# Altium project Sonar_Digital_Shield.PrjPcb
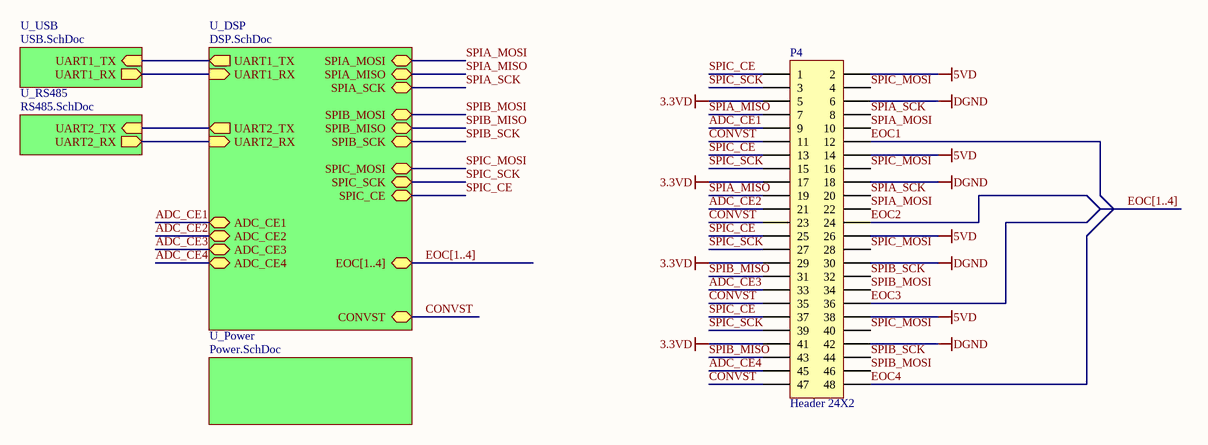
[diagram p0: Top_Level.SchDoc]
4 sheets, 71 parts. Net scope: hierarchical (ports join the sheet entries above them; power ports are global).
Board file: Digital.PcbDoc
Sheets:
  Top_Level.SchDoc
    U_DSP = DSP.SchDoc
    U_Power = Power.SchDoc
    U_USB = USB.SchDoc

## Sheet Top_Level.SchDoc
size 381 x 241 mm

### Parts
P4  Header 24X2  [HDR2X24]

### Sub-sheets
U_DSP = DSP.SchDoc: SPIA_MOSI (bidir), SPIA_MISO (bidir), SPIA_SCK (bidir), SPIB_MISO (bidir), SPIB_MOSI (bidir), SPIB_SCK (bidir), SPIC_MOSI (bidir), SPIC_SCK (bidir), SPIC_CE (bidir), CONVST (bidir), ADC_CE1 (bidir), ADC_CE2 (bidir), ADC_CE4 (bidir), ADC_CE3 (bidir), EOC[1..4] (bidir), UART2_TX (out), UART1_TX (out), UART1_RX (in), UART2_RX (in)
U_Power = Power.SchDoc: no entries
U_RS485 = RS485.SchDoc (file not in this document): UART2_RX (out), UART2_TX (in)
U_USB = USB.SchDoc: UART1_RX (out), UART1_TX (in)

### Nets
3.3VD: P4.5 P4.17 P4.29 P4.41
5VD: P4.2 P4.14 P4.26 P4.38
DGND: P4.6 P4.18 P4.30 P4.42
ADC_CE1: P4.9 ; sheet U_DSP/ADC_CE1
ADC_CE2: P4.21 ; sheet U_DSP/ADC_CE2
ADC_CE3: P4.33 ; sheet U_DSP/ADC_CE3
ADC_CE4: P4.45 ; sheet U_DSP/ADC_CE4
CONVST: P4.11 P4.23 P4.35 P4.47 ; sheet U_DSP/CONVST
EOC1: P4.12
EOC2: P4.24
EOC3: P4.36
EOC4: P4.48
SPIA_MISO: P4.7 P4.19 ; sheet U_DSP/SPIA_MISO
SPIA_MOSI: P4.10 P4.22 ; sheet U_DSP/SPIA_MOSI
SPIA_SCK: P4.8 P4.20 ; sheet U_DSP/SPIA_SCK
SPIB_MISO: P4.31 P4.43 ; sheet U_DSP/SPIB_MISO
SPIB_MOSI: P4.34 P4.46 ; sheet U_DSP/SPIB_MOSI
SPIB_SCK: P4.32 P4.44 ; sheet U_DSP/SPIB_SCK
SPIC_CE: P4.1 P4.13 P4.25 P4.37 ; sheet U_DSP/SPIC_CE
SPIC_MOSI: P4.4 P4.16 P4.28 P4.40 ; sheet U_DSP/SPIC_MOSI
SPIC_SCK: P4.3 P4.15 P4.27 P4.39 ; sheet U_DSP/SPIC_SCK
UART1_RX: sheet U_DSP/UART1_RX, sheet U_USB/UART1_RX
UART1_TX: sheet U_DSP/UART1_TX, sheet U_USB/UART1_TX
NetU1_98: sheet U_DSP/UART2_TX, sheet U_RS485/UART2_TX
NetU1_100: sheet U_DSP/UART2_RX, sheet U_RS485/UART2_RX

### Buses and harness runs
bus EOC[1..4]
bus EOC[1..4] = sheet U_DSP/EOC[1..4]

### Library data of the parts
P4 = Header 24X2: Header, 24-Pin, Dual row; LatestRevisionDate: 17-Jul-2002; LatestRevisionNote: Re-released for DXP Platform.; Publisher: Altium Limited; Supplier Part Number 1: 952-1917-ND; Supplier 1: Digi-Key

## Sheet DSP.SchDoc
size 381 x 241 mm
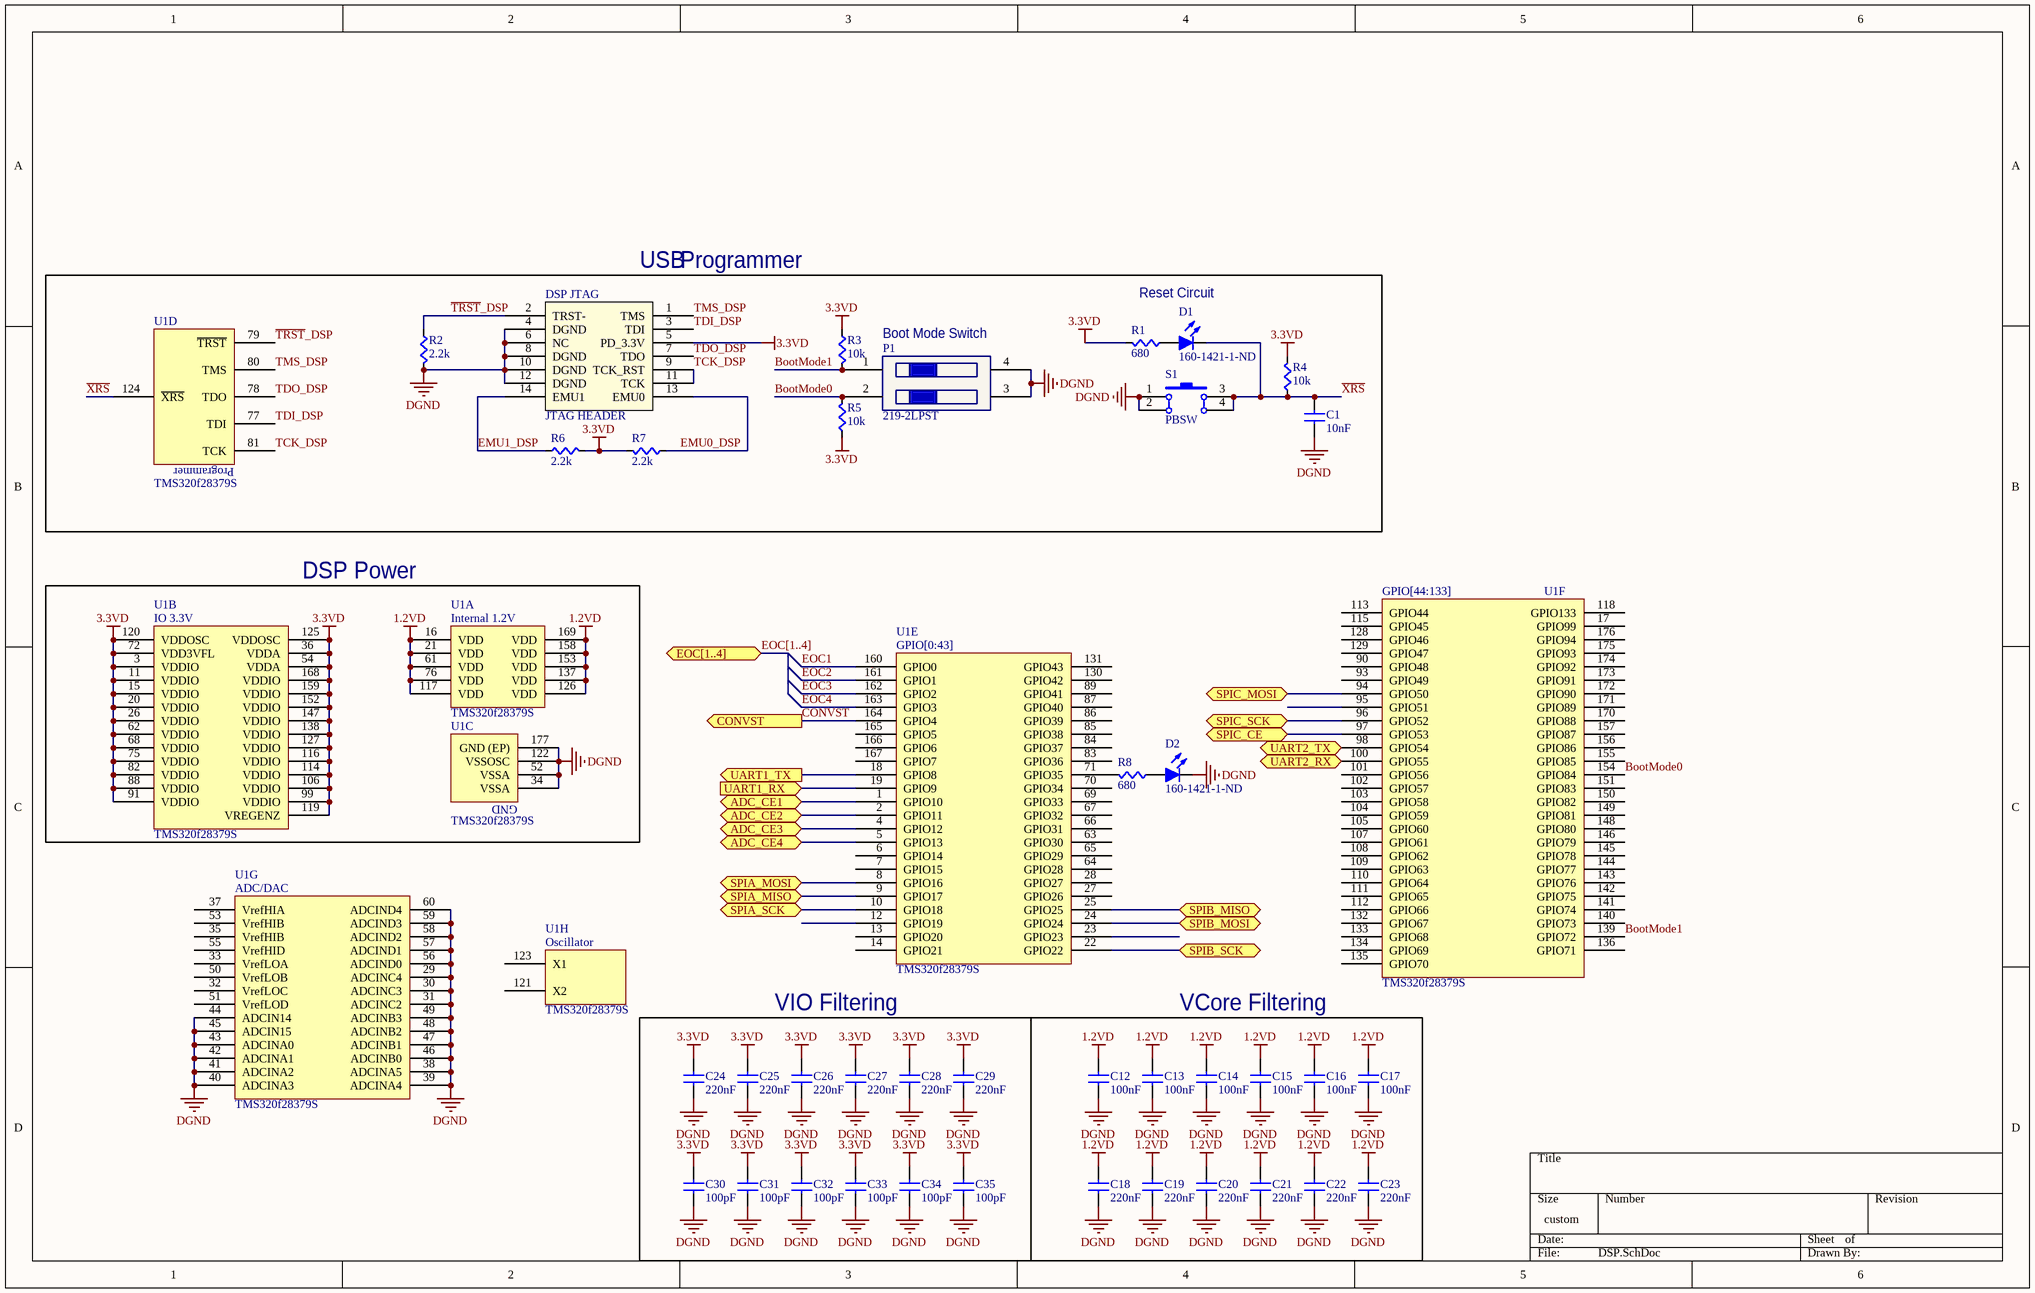
[diagram p1: DSP.SchDoc]

### Parts
C1  value 10nF  [CAPC0603]  (hidden comment: Cap)
C12  value 100nF  [CAPC0603]  (hidden comment: Cap)
C13  value 100nF  [CAPC0603]  (hidden comment: Cap)
C14  value 100nF  [CAPC0603]  (hidden comment: Cap)
C15  value 100nF  [CAPC0603]  (hidden comment: Cap)
C16  value 100nF  [CAPC0603]  (hidden comment: Cap)
C17  value 100nF  [CAPC0603]  (hidden comment: Cap)
C18  value 220nF  [CAPC0603]  (hidden comment: Cap)
C19  value 220nF  [CAPC0603]  (hidden comment: Cap)
C20  value 220nF  [CAPC0603]  (hidden comment: Cap)
C21  value 220nF  [CAPC0603]  (hidden comment: Cap)
C22  value 220nF  [CAPC0603]  (hidden comment: Cap)
C23  value 220nF  [CAPC0603]  (hidden comment: Cap)
C24  value 220nF  [CAPC0603]  (hidden comment: Cap)
C25  value 220nF  [CAPC0603]  (hidden comment: Cap)
C26  value 220nF  [CAPC0603]  (hidden comment: Cap)
C27  value 220nF  [CAPC0603]  (hidden comment: Cap)
C28  value 220nF  [CAPC0603]  (hidden comment: Cap)
C29  value 220nF  [CAPC0603]  (hidden comment: Cap)
C30  value 100pF  [CAPC0603]  (hidden comment: Cap)
C31  value 100pF  [CAPC0603]  (hidden comment: Cap)
C32  value 100pF  [CAPC0603]  (hidden comment: Cap)
C33  value 100pF  [CAPC0603]  (hidden comment: Cap)
C34  value 100pF  [CAPC0603]  (hidden comment: Cap)
C35  value 100pF  [CAPC0603]  (hidden comment: Cap)
D1  Supplier Part Number 1: 160-1421-1-ND  [LED0805-RED]  (hidden comment: LED-RED)
D2  Supplier Part Number: 160-1421-1-ND  [LED0805-RED]  (hidden comment: LED-RED)
DSP_JTAG  JTAG HEADER  [JTAG HEADER - 14]
P1  219-2LPST  [SPST-4N]
R1  value 680  [RES0603]  (hidden comment: Res)
R2  value 2.2k  [RES0603]  (hidden comment: Res)
R3  value 10k  [RES0603]  (hidden comment: Res)
R4  value 10k  [RES0603]  (hidden comment: Res)
R5  value 10k  [RES0603]  (hidden comment: Res)
R6  value 2.2k  [RES0603]  (hidden comment: Res)
R7  value 2.2k  [RES0603]  (hidden comment: Res)
R8  value 680  [RES0603]  (hidden comment: Res)
S1  PBSW  [PBSW]
U1  TMS320f28379S  [PQFP-177N]  (parts A,B,C,D,E,F,G,H of 8)

### Blocks framed on the sheet
DSP Power: U1
VIO Filtering: C24-C35
VCore Filtering: C12-C23

### Ports
ADC_CE1 (bidir), ADC_CE2 (bidir), ADC_CE3 (bidir), ADC_CE4 (bidir), CONVST (out), EOC[1..4] (bidir), SPIA_MISO (bidir), SPIA_MOSI (bidir), SPIA_SCK (bidir), SPIB_MISO (bidir), SPIB_MOSI (bidir), SPIB_SCK (bidir), SPIC_CE (bidir), SPIC_MOSI (bidir), SPIC_SCK (bidir), UART1_RX (in), UART1_TX (out), UART2_RX (in), UART2_TX (out)

### Nets
1: S1.2(A')
1.2VD: C12.1(A) C13.1(A) C14.1(A) C15.1(A) C16.1(A) C17.1(A) C18.1(A) C19.1(A) C20.1(A) C21.1(A) C22.1(A) C23.1(A) U1.16(VDD) U1.21(VDD) U1.61(VDD) U1.76(VDD) U1.117(VDD) U1.126(VDD) U1.137(VDD) U1.153(VDD) U1.158(VDD) U1.169(VDD)
3: S1.4(B')
3.3VD: C24.1(A) C25.1(A) C26.1(A) C27.1(A) C28.1(A) C29.1(A) C30.1(A) C31.1(A) C32.1(A) C33.1(A) C34.1(A) C35.1(A) DSP_JTAG.5(PD_3.3V) R1.1(A) R3.2(B) R4.1(A) R5.2(B) R6.1(A) R7.1(A) U1.3(VDDIO) U1.11(VDDIO) U1.15(VDDIO) U1.20(VDDIO) U1.26(VDDIO) U1.36(VDDA) U1.54(VDDA) U1.62(VDDIO) U1.68(VDDIO) U1.72(VDD3VFL) U1.75(VDDIO) U1.82(VDDIO) U1.88(VDDIO) U1.91(VDDIO) U1.99(VDDIO) U1.106(VDDIO) U1.114(VDDIO) U1.116(VDDIO) U1.119(VREGENZ) U1.120(VDDOSC) U1.125(VDDOSC) U1.127(VDDIO) U1.138(VDDIO) U1.147(VDDIO) U1.152(VDDIO) U1.159(VDDIO) U1.168(VDDIO)
DGND: C1.2(B) C12.2(B) C13.2(B) C14.2(B) C15.2(B) C16.2(B) C17.2(B) C18.2(B) C19.2(B) C20.2(B) C21.2(B) C22.2(B) C23.2(B) C24.2(B) C25.2(B) C26.2(B) C27.2(B) C28.2(B) C29.2(B) C30.2(B) C31.2(B) C32.2(B) C33.2(B) C34.2(B) C35.2(B) D2.1(K) DSP_JTAG.4(DGND) DSP_JTAG.6(NC) DSP_JTAG.8(DGND) DSP_JTAG.10(DGND) DSP_JTAG.12(DGND) P1.3 P1.4 R2.1(A) S1.1(A) S1.2(A') U1.29(ADCINC4) U1.30(ADCINC3) U1.31(ADCINC2) U1.34(VSSA) U1.38(ADCINA5) U1.39(ADCINA4) U1.40(ADCINA3) U1.41(ADCINA2) U1.42(ADCINA1) U1.43(ADCINA0) U1.44(ADCIN14) U1.45(ADCIN15) U1.46(ADCINB0) U1.47(ADCINB1) U1.48(ADCINB2) U1.49(ADCINB3) U1.52(VSSA) U1.56(ADCIND0) U1.57(ADCIND1) U1.58(ADCIND2) U1.59(ADCIND3) U1.60(ADCIND4) U1.122(VSSOSC) U1.177(GND_(EP))
ADC_CE1: U1.1(GPIO10) ; port ADC_CE1
ADC_CE2: U1.2(GPIO11) ; port ADC_CE2
ADC_CE3: U1.4(GPIO12) ; port ADC_CE3
ADC_CE4: U1.5(GPIO13) ; port ADC_CE4
BootMode0: P1.2 R5.1(A) U1.154(GPIO84)
BootMode1: P1.1 R3.1(A) U1.139(GPIO72)
CONVST: U1.164(GPIO4) ; port CONVST
EMU0_DSP: DSP_JTAG.13(EMU0) R7.2(B)
EMU1_DSP: DSP_JTAG.14(EMU1) R6.2(B)
EOC1: U1.160(GPIO0)
EOC2: U1.161(GPIO1)
EOC3: U1.162(GPIO2)
EOC4: U1.163(GPIO3)
SPIA_MISO: U1.9(GPIO17) ; port SPIA_MISO
SPIA_MOSI: U1.8(GPIO16) ; port SPIA_MOSI
SPIA_SCK: U1.10(GPIO18) ; port SPIA_SCK
SPIB_MISO: U1.25(GPIO25) ; port SPIB_MISO
SPIB_MOSI: U1.24(GPIO24) ; port SPIB_MOSI
SPIB_SCK: U1.22(GPIO22) ; port SPIB_SCK
SPIC_CE: U1.97(GPIO53) ; port SPIC_CE
SPIC_MOSI: U1.94(GPIO50) ; port SPIC_MOSI
SPIC_SCK: U1.96(GPIO52) ; port SPIC_SCK
~{TRST}_DSP: DSP_JTAG.2(TRST-) R2.2(B) U1.79(~{TRST})
TCK_DSP: DSP_JTAG.9(TCK_RST) DSP_JTAG.11(TCK) U1.81(TCK)
TDI_DSP: DSP_JTAG.3(TDI) U1.77(TDI)
TDO_DSP: DSP_JTAG.7(TDO) U1.78(TDO)
TMS_DSP: DSP_JTAG.1(TMS) U1.80(TMS)
UART1_RX: U1.19(GPIO9) ; port UART1_RX
UART1_TX: U1.18(GPIO8) ; port UART1_TX
~{XRS}: C1.1(A) D1.1(K) R4.2(B) S1.3(B) S1.4(B') U1.124(~{XRS})
NetD1_2: D1.2(A) R1.2(B)
NetD2_2: D2.2(A) R8.2(B)
NetR8_1: R8.1(A) U1.71(GPIO35)
NetU1_98: U1.98(GPIO54) ; port UART2_TX
NetU1_100: U1.100(GPIO55) ; port UART2_RX

Not connected (* = marked no-connect by the designer): U1 6(GPIO14) 7(GPIO15) 12(GPIO19) 13(GPIO20) 14(GPIO21) 17(GPIO99) 23(GPIO23) 27(GPIO26) 28(GPIO27) 32(VrefLOC) 33(VrefLOA) 35(VrefHIB) 37(VrefHIA) 50(VrefLOB) 51(VrefLOD) 53(VrefHIB) 55(VrefHID) 63(GPIO30) 64(GPIO28) 65(GPIO29) 66(GPIO31) 67(GPIO32) 69(GPIO33) 70(GPIO34) 83(GPIO36) 84(GPIO37) 85(GPIO38) 86(GPIO39) 87(GPIO40) 89(GPIO41) 90(GPIO48) 93(GPIO49) 95(GPIO51) 101(GPIO56) 102(GPIO57) 103(GPIO58) 104(GPIO59) 105(GPIO60) 107(GPIO61) 108(GPIO62) 109(GPIO63) 110(GPIO64) 111(GPIO65) 112(GPIO66) 113(GPIO44) 115(GPIO45) 118(GPIO133) 121(X2) 123(X1) 128(GPIO46) 129(GPIO47) 130(GPIO42) 131(GPIO43) 132(GPIO67) 133(GPIO68) 134(GPIO69) 135(GPIO70) 136(GPIO71) 140(GPIO73) 141(GPIO74) 142(GPIO75) 143(GPIO76) 144(GPIO77) 145(GPIO78) 146(GPIO79) 148(GPIO80) 149(GPIO81) 150(GPIO82) 151(GPIO83) 155(GPIO85) 156(GPIO86) 157(GPIO87) 165(GPIO5) 166(GPIO6) 167(GPIO7) 170(GPIO88) 171(GPIO89) 172(GPIO90) 173(GPIO91) 174(GPIO92) 175(GPIO93) 176(GPIO94)

### Buses and harness runs
bus EOC[1..4] = port EOC[1..4]

### Notes on the sheet
- (near DSP_JTAG) USB
- Programmer
- Reset Circuit
- Boot Mode Switch
- (in symbol TMS320f28379S, part A) Internal 1.2V
- (in symbol TMS320f28379S, part B) IO 3.3V
- (in symbol TMS320f28379S, part C) GND
- (in symbol TMS320f28379S, part D) Programmer
- (in symbol TMS320f28379S, part E) GPIO[0:43]
- (in symbol TMS320f28379S, part F) GPIO[44:133]
- (in symbol TMS320f28379S, part G) ADC/DAC
- (in symbol TMS320f28379S, part H) Oscillator

### Library data of the parts
D1 D2 = LED-RED: Light Emitting Diode - RED; Manufacturer Part Number: LTST-C171CKT; Manufacturer: Lite-On Inc; Voltage - Forward (Vf) Typ: 1.8V; Current - Test: 20mA; Millicandela Rating: 25mcd; Viewing Angle: 130°; Color: Red; Package / Case: 0805 (2012 Metric)
  D1: Supplier 1: Digi-Key
  D2: Supplier: Digi-Key
DSP_JTAG = JTAG-TI_14: 14 Pin JTAG Header; Supplier Part Number 1: 609-3491-ND; Supplier 1: Digi-Key
P1 = SPST-2DIP-SW: SWITCH TAPE SEAL 2 POS SMD 50V; Supplier 1: Digi-Key; Supplier Part Number 1: CT2192LPST-ND
S1 = SW-PB: Push Button Switch; Manufacturer: Panasonic Electronic Components; Manufacturer Part Number: EVQ-9P105M; Outline: 6.10mm x 6.00mm; Actuator Orientation: Top Actuated; Actuator Height off PCB, from Pins: 5.00mm; Published: 24-Mar-1999; LatestRevisionDate: 17-Jul-2002; LatestRevisionNote: Re-released for DXP Platform.; PackageReference: SPST-2; Publisher: Altium Limited; PackageDescription: Switch; 2 Leads; Supplier 1: Digi-Key; Supplier Part Number 1: P13586SCT-ND
U1 = TMS320f28379S: IC MCU 200MHZ FPU DSP; Supplier 1: Digi-Key; Supplier Part Number 1: TMS320F28379SPTPT-ND
C1 C12-C35 = Cap: Supplier 1: Digi-Key; Supplier Part Number 1: 1276-1000-1-ND
R1-R8 = Res: Supplier 1: Digi-Key; Supplier Part Number 1: RMCF0603JT10K0CT-ND

## Sheet Power.SchDoc
size A
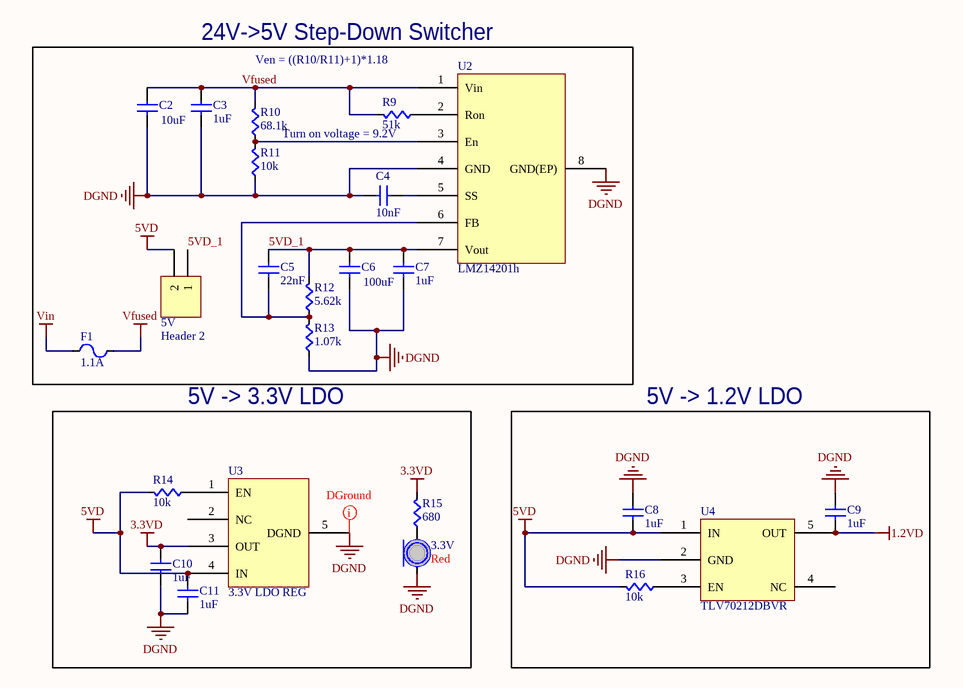
[diagram p2: Power.SchDoc]

### Parts
3.3V  Color: Red  [LED0805]  (hidden comment: LED)
5V  Header 2  [HDR1X2]
C2  value 10uF  [CAP1210]  (hidden comment: CAP1210)
C3  value 1uF  [CAP1206]  (hidden comment: Cap1206)
C4  value 10nF  [CAPC0603]  (hidden comment: Cap)
C5  value 22nF  [CAPC0603]  (hidden comment: Cap)
C6  value 100uF  [CAP1210]  (hidden comment: CAP1210)
C7  value 1uF  [CAP1206]  (hidden comment: Cap1206)
C8  value 1uF  [CAPC0603]  (hidden comment: Cap1206)
C9  value 1uF  [CAPC0603]  (hidden comment: Cap1206)
C10  value 1uF  [CAPC0603]  (hidden comment: Cap1206)
C11  value 1uF  [CAPC0603]  (hidden comment: Cap1206)
F1  value 1.1A  [PTC7451X11N]  (hidden comment: PTC Fuse)
R9  value 51k  [RES0603]  (hidden comment: Res)
R10  value 68.1k  [RES0603]  (hidden comment: Res)
R11  value 10k  [RES0603]  (hidden comment: Res)
R12  value 5.62k  [RES0603]  (hidden comment: Res)
R13  value 1.07k  [RES0603]  (hidden comment: Res)
R14  value 10k  [RES0603]  (hidden comment: Res)
R15  value 680  [RES0603]  (hidden comment: Res)
R16  value 10k  [RES0603]  (hidden comment: Res)
U2  LMZ14201h  [TO-PMOD-7]
U3  3.3V LDO REG  [SOT223-8N]
U4  TLV70212DBVR  [SOT23-5N]

### Blocks framed on the sheet
24V->5V Step-Down Switcher: 5V C2-C7 F1 R9-R13 U2
5V -> 3.3V LDO: 3.3V C10 C11 R14 R15 U3
5V -> 1.2V LDO: C8 C9 R16 U4

### Nets
1.2VD: C9.1(A) U4.5(OUT)
3.3VD: C10.1(A) R15.1(A) U3.3(OUT)
5VD: 5V.2 C8.1(A) C11.1(A) R14.1(A) R16.1(A) U3.4(IN) U4.1(IN)
DGND: 3.3V.C C2.2(B) C3.2(B) C4.1(A) C6.2(B) C7.2(B) C8.2(B) C9.2(B) C10.2(B) C11.2(B) R11.2(B) R13.2(B) U2.4(GND) U2.8(GND(EP)) U3.5(DGND) U4.2(GND)
Vfused: C2.1(A) C3.1(A) F1.2(B) R9.1(A) R10.1(A) U2.1(Vin)
Vin: F1.1(A)
5VD_1: 5V.1 C5.2(B) C6.1(A) C7.1(A) R12.1(A) U2.7(Vout)
Net3.3V_A: 3.3V.A R15.2(B)
NetC4_2: C4.2(B) U2.5(SS)
NetC5_1: C5.1(A) R12.2(B) R13.1(A) U2.6(FB)
NetR9_2: R9.2(B) U2.2(Ron)
NetR10_2: R10.2(B) R11.1(A) U2.3(En)
NetR14_2: R14.2(B) U3.1(EN)
NetR16_2: R16.2(B) U4.3(EN)

Not connected (* = marked no-connect by the designer): U3 2(NC); U4 4(NC)

### Layout directives
net class DGround: DGND

### Notes on the sheet
- Ven = ((R10/R11)+1)*1.18
- (near R9) Turn on voltage = 9.2V

### Library data of the parts
5V = Header 2: Header, 2-Pin; LatestRevisionDate: 17-Jul-2002; LatestRevisionNote: Re-released for DXP Platform.; Publisher: Altium Limited; Supplier Part Number 1: A1921-ND; Supplier 1: Digi-Key
C2 C6 = CAP1210: CAP CER 10UF 50V 20% X5R 1210; Supplier 1: Digi-Key
  C2: Supplier Part Number 1: 587-2225-1-ND
  C6: Supplier Part Number 1: 587-1387-1-ND
C3 C7-C11 = Cap1206: CAP CER 1UF 50V 10% X7R 1206; Supplier 1: Digi-Key; Supplier Part Number 1: 587-2230-1-ND
F1 = PTC_Fuse: Supplier 1: Digi-Key; Supplier Part Number 1: 507-1744-1-ND
U2 = LMZ14201h: IC BUCK SYNC ADJ 1A TO-PMOD-7; Supplier 1: Digi-Key; Supplier Part Number 1: LMZ14201HTZX/NOPBCT-ND
U3 = LP38691: IC REG LDO 3.3V 0.5A SOT223-5; Supplier 1: Digi-Key; Supplier Part Number 1: LP38693MP-3.3/NOPBCT-ND
U4 = TLV70212DBVR: IC REG LDO 1.2V 0.3A SOT23-5; Supplier 1: Digi-Key; Supplier Part Number 1: 296-29583-1-ND
3.3V = LED: Supplier 1: Digi-Key; Supplier Part Number 1: 754-1122-1-ND
C4 C5 = Cap: Supplier 1: Digi-Key; Supplier Part Number 1: 1276-1000-1-ND
R9-R16 = Res: Supplier 1: Digi-Key; Supplier Part Number 1: RMCF0603JT10K0CT-ND

## Sheet USB.SchDoc
size A
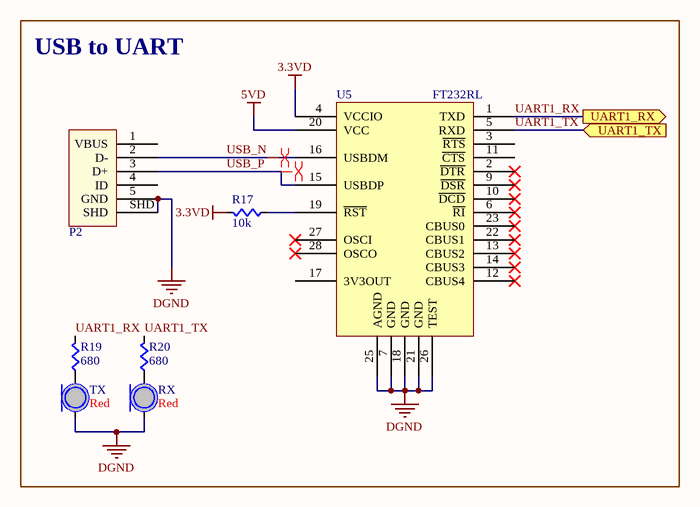
[diagram p3: USB.SchDoc]

### Parts
P2  USB Micro  [10118192-0001LF]  (value not drawn)
R17  value 10k  [RES0603]  (hidden comment: Res)
R19  value 680  [RES0603]  (hidden comment: Res)
R20  value 680  [RES0603]  (hidden comment: Res)
RX  Color: Red  [LED0603]  (hidden comment: LED)
TX  Color: Red  [LED0603]  (hidden comment: LED)
U5  FT232RL  [SSOP_28_N]

### Blocks framed on the sheet
USB to UART: P2 R17 R19 R20 RX TX U5

### Ports
UART1_RX (out), UART1_TX (in)

### Nets
3.3VD: R17.1(A) U5.4(VCCIO)
5VD: U5.20(VCC)
DGND: P2.5(GND) P2.SHD RX.C TX.C U5.7(GND) U5.18(GND) U5.21(GND) U5.25(AGND) U5.26(TEST)
UART1_RX: R19.1(A) U5.1(TXD) ; port UART1_RX
UART1_TX: R20.1(A) U5.5(RXD) ; port UART1_TX
USB_N: P2.2(D-) U5.16(USBDM)
USB_P: P2.3(D+) U5.15(USBDP)
NetR17_2: R17.2(B) U5.19(~{RST})
NetR19_2: R19.2(B) TX.A
NetR20_2: R20.2(B) RX.A

Not connected (* = marked no-connect by the designer): P2 1(VBUS) 4(ID); U5 2(~{DTR})* 3(~{RTS}) 6(~{RI})* 9(~{DSR})* 10(~{DCD})* 11(~{CTS}) 12(CBUS4)* 13(CBUS2)* 14(CBUS3)* 17(3V3OUT) 22(CBUS1)* 23(CBUS0)* 27(OSCI)* 28(OSCO)*

### Layout directives
differential pair: USB_N, USB_P

### Library data of the parts
P2 = USB Micro: USB Mini B Metal Shield SMT; Supplier 1: Digi-Key; Supplier Part Number 1: 609-4613-1-ND
U5 = FT232RL: IC USB FS SERIAL UART 28-SSOP; Supplier Part Number 1: 768-1007-1-ND; Supplier 1: Digi-Key
R17 R19 R20 = Res: Supplier 1: Digi-Key; Supplier Part Number 1: RMCF0603JT10K0CT-ND
RX TX = LED: Supplier 1: Digi-Key; Supplier Part Number 1: 754-1122-1-ND

## Nets that join several sheets
1.2VD: DSP (22 pins), Power (C9.1 U4.5)
3.3VD: Top_Level (P4.5 P4.17 P4.29 P4.41), DSP (46 pins), Power (C10.1 R15.1 U3.3), USB (R17.1 U5.4)
5VD: Top_Level (P4.2 P4.14 P4.26 P4.38), Power (7 pins), USB (U5.20)
DGND: Top_Level (P4.6 P4.18 P4.30 P4.42), DSP (60 pins), Power (16 pins), USB (9 pins)
ADC_CE1: Top_Level (P4.9), DSP (U1.1)
ADC_CE2: Top_Level (P4.21), DSP (U1.2)
ADC_CE3: Top_Level (P4.33), DSP (U1.4)
ADC_CE4: Top_Level (P4.45), DSP (U1.5)
CONVST: Top_Level (P4.11 P4.23 P4.35 P4.47), DSP (U1.164)
EOC1: Top_Level (P4.12), DSP (U1.160)
EOC2: Top_Level (P4.24), DSP (U1.161)
EOC3: Top_Level (P4.36), DSP (U1.162)
EOC4: Top_Level (P4.48), DSP (U1.163)
SPIA_MISO: Top_Level (P4.7 P4.19), DSP (U1.9)
SPIA_MOSI: Top_Level (P4.10 P4.22), DSP (U1.8)
SPIA_SCK: Top_Level (P4.8 P4.20), DSP (U1.10)
SPIB_MISO: Top_Level (P4.31 P4.43), DSP (U1.25)
SPIB_MOSI: Top_Level (P4.34 P4.46), DSP (U1.24)
SPIB_SCK: Top_Level (P4.32 P4.44), DSP (U1.22)
SPIC_CE: Top_Level (P4.1 P4.13 P4.25 P4.37), DSP (U1.97)
SPIC_MOSI: Top_Level (P4.4 P4.16 P4.28 P4.40), DSP (U1.94)
SPIC_SCK: Top_Level (P4.3 P4.15 P4.27 P4.39), DSP (U1.96)
UART1_RX: DSP (U1.19), USB (R19.1 U5.1)
UART1_TX: DSP (U1.18), USB (R20.1 U5.5)